# EasyEDA schematic pcb.json

## Sheets
1 Sheet_2: TITLE: Sheet_2; REV: 1.0; Date: 2019-10-17; Sheet: 1/1; Drawn By: Sobotkama; Company: Your Company
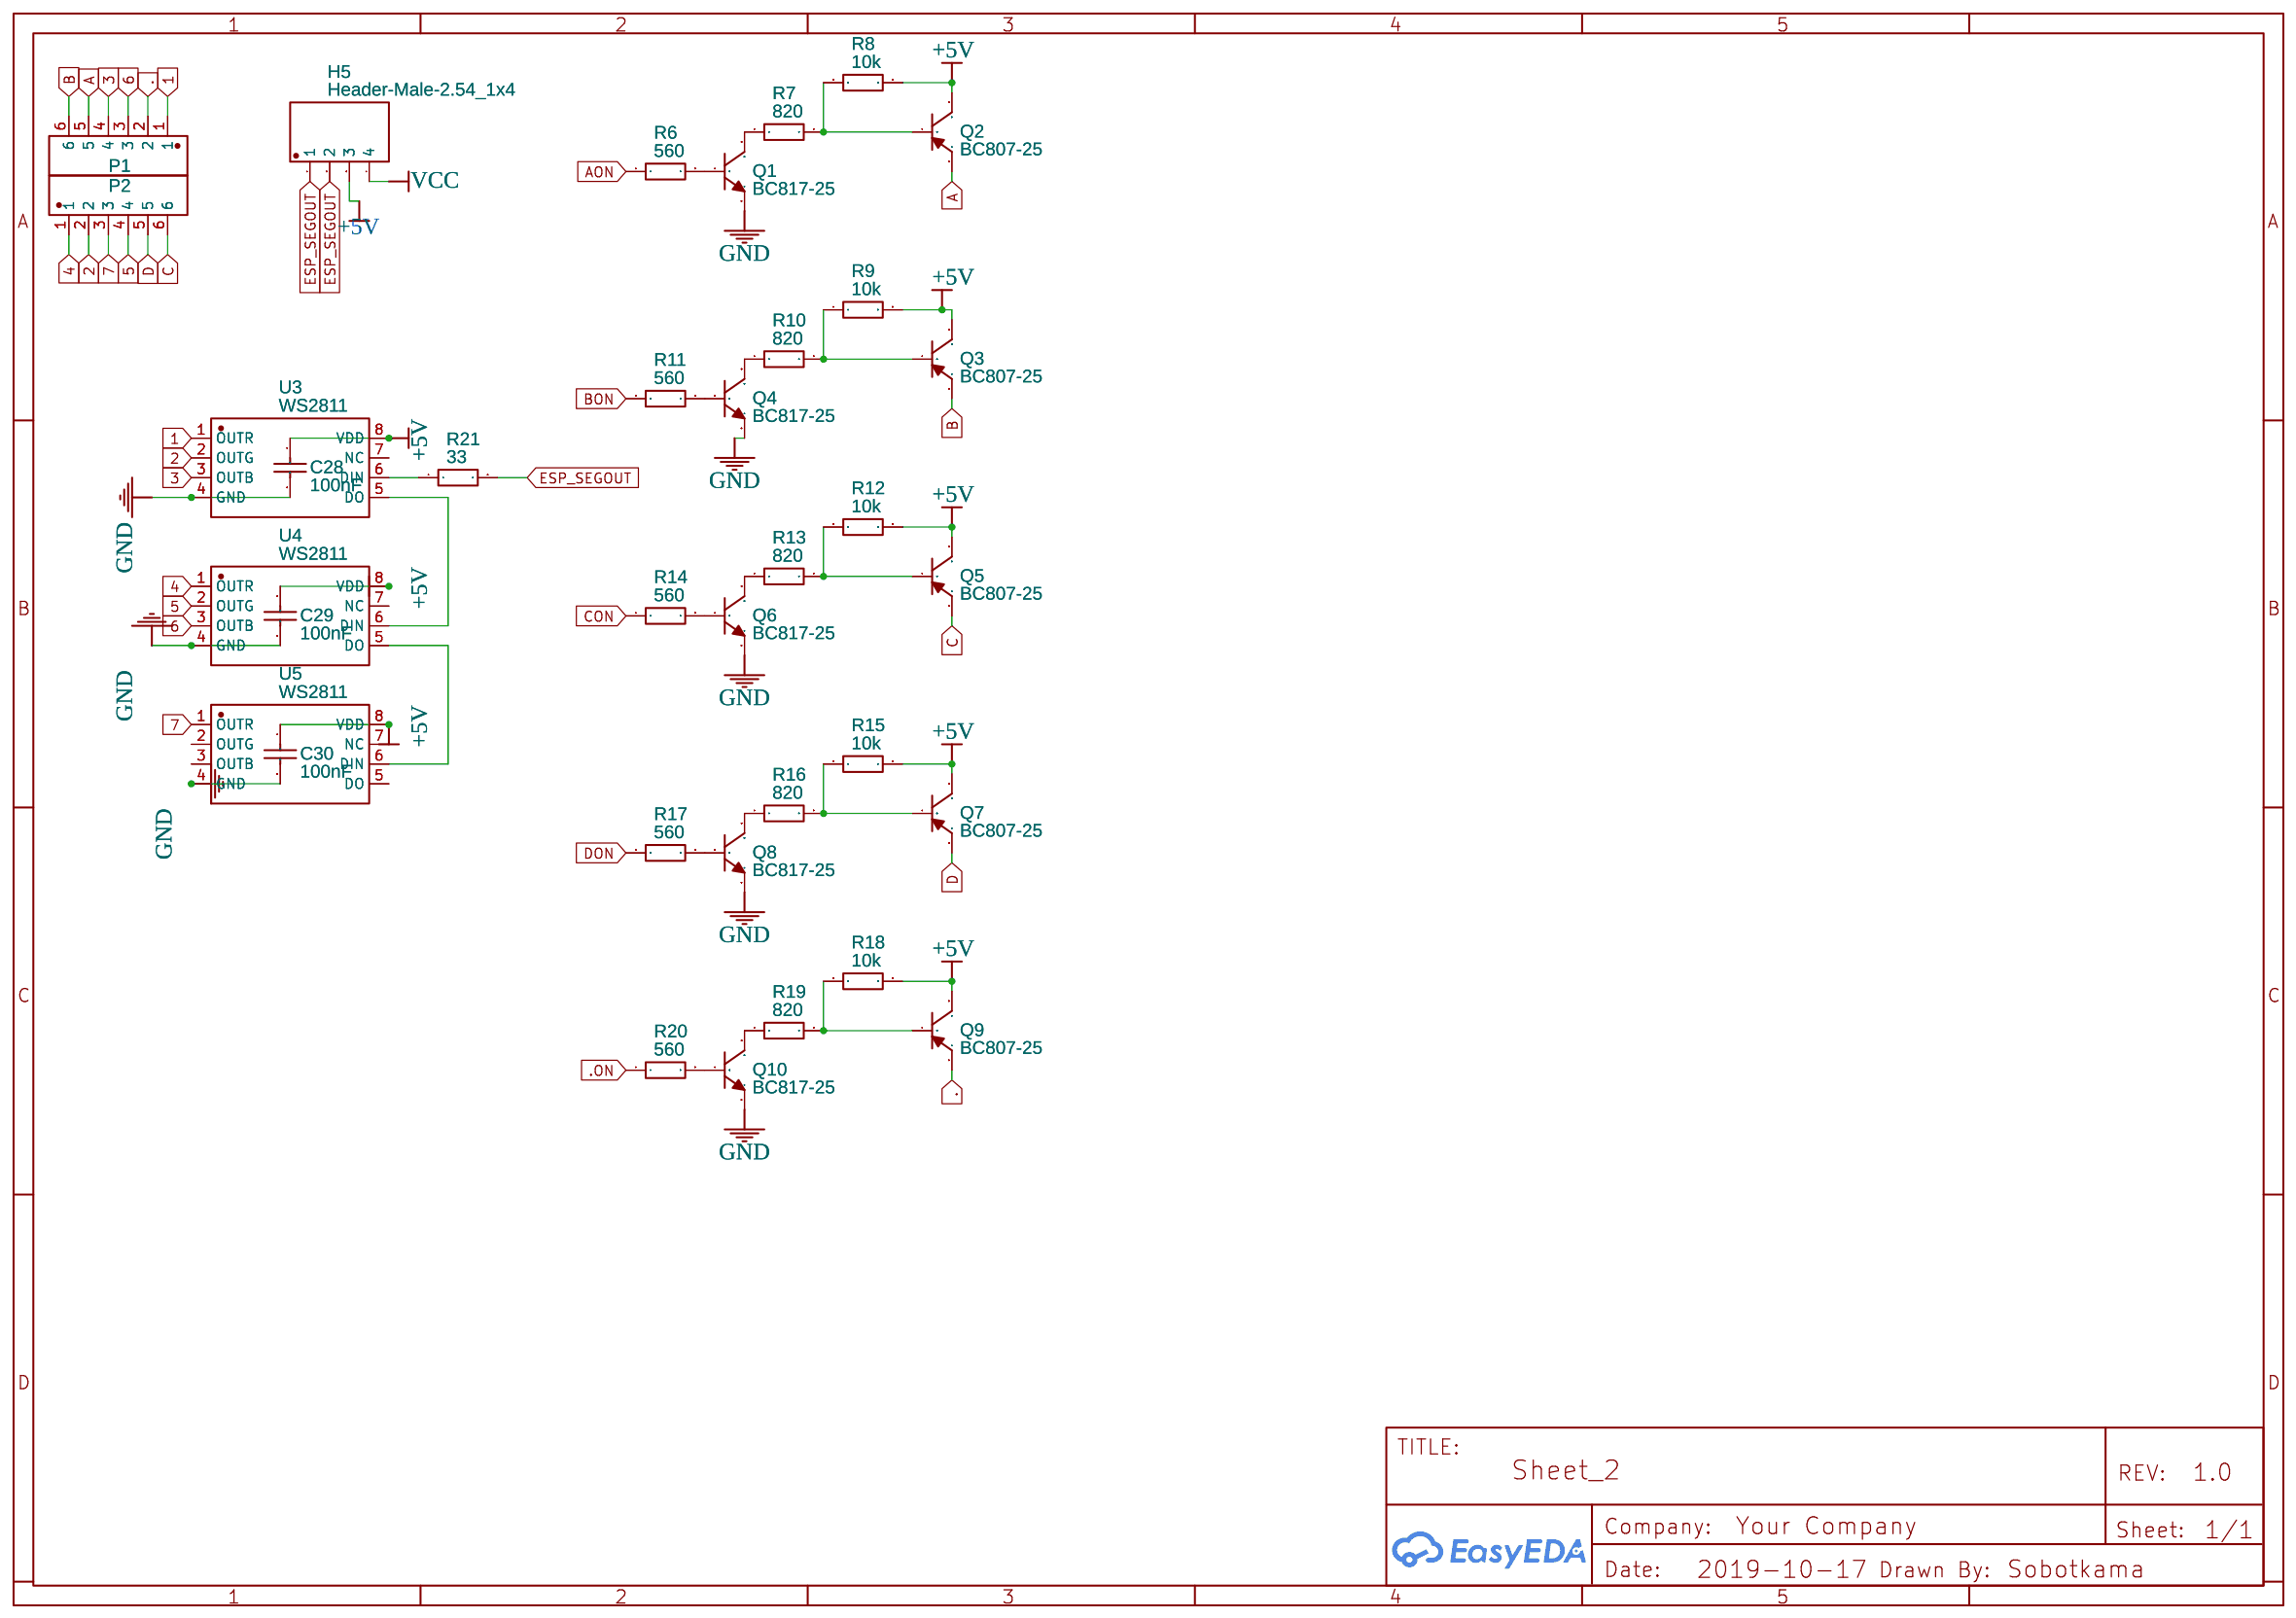
[diagram p0: Sheet_2]
2 Sheet_1: TITLE: Sheet_1; Date: 2019-09-26; Company: DDM P9
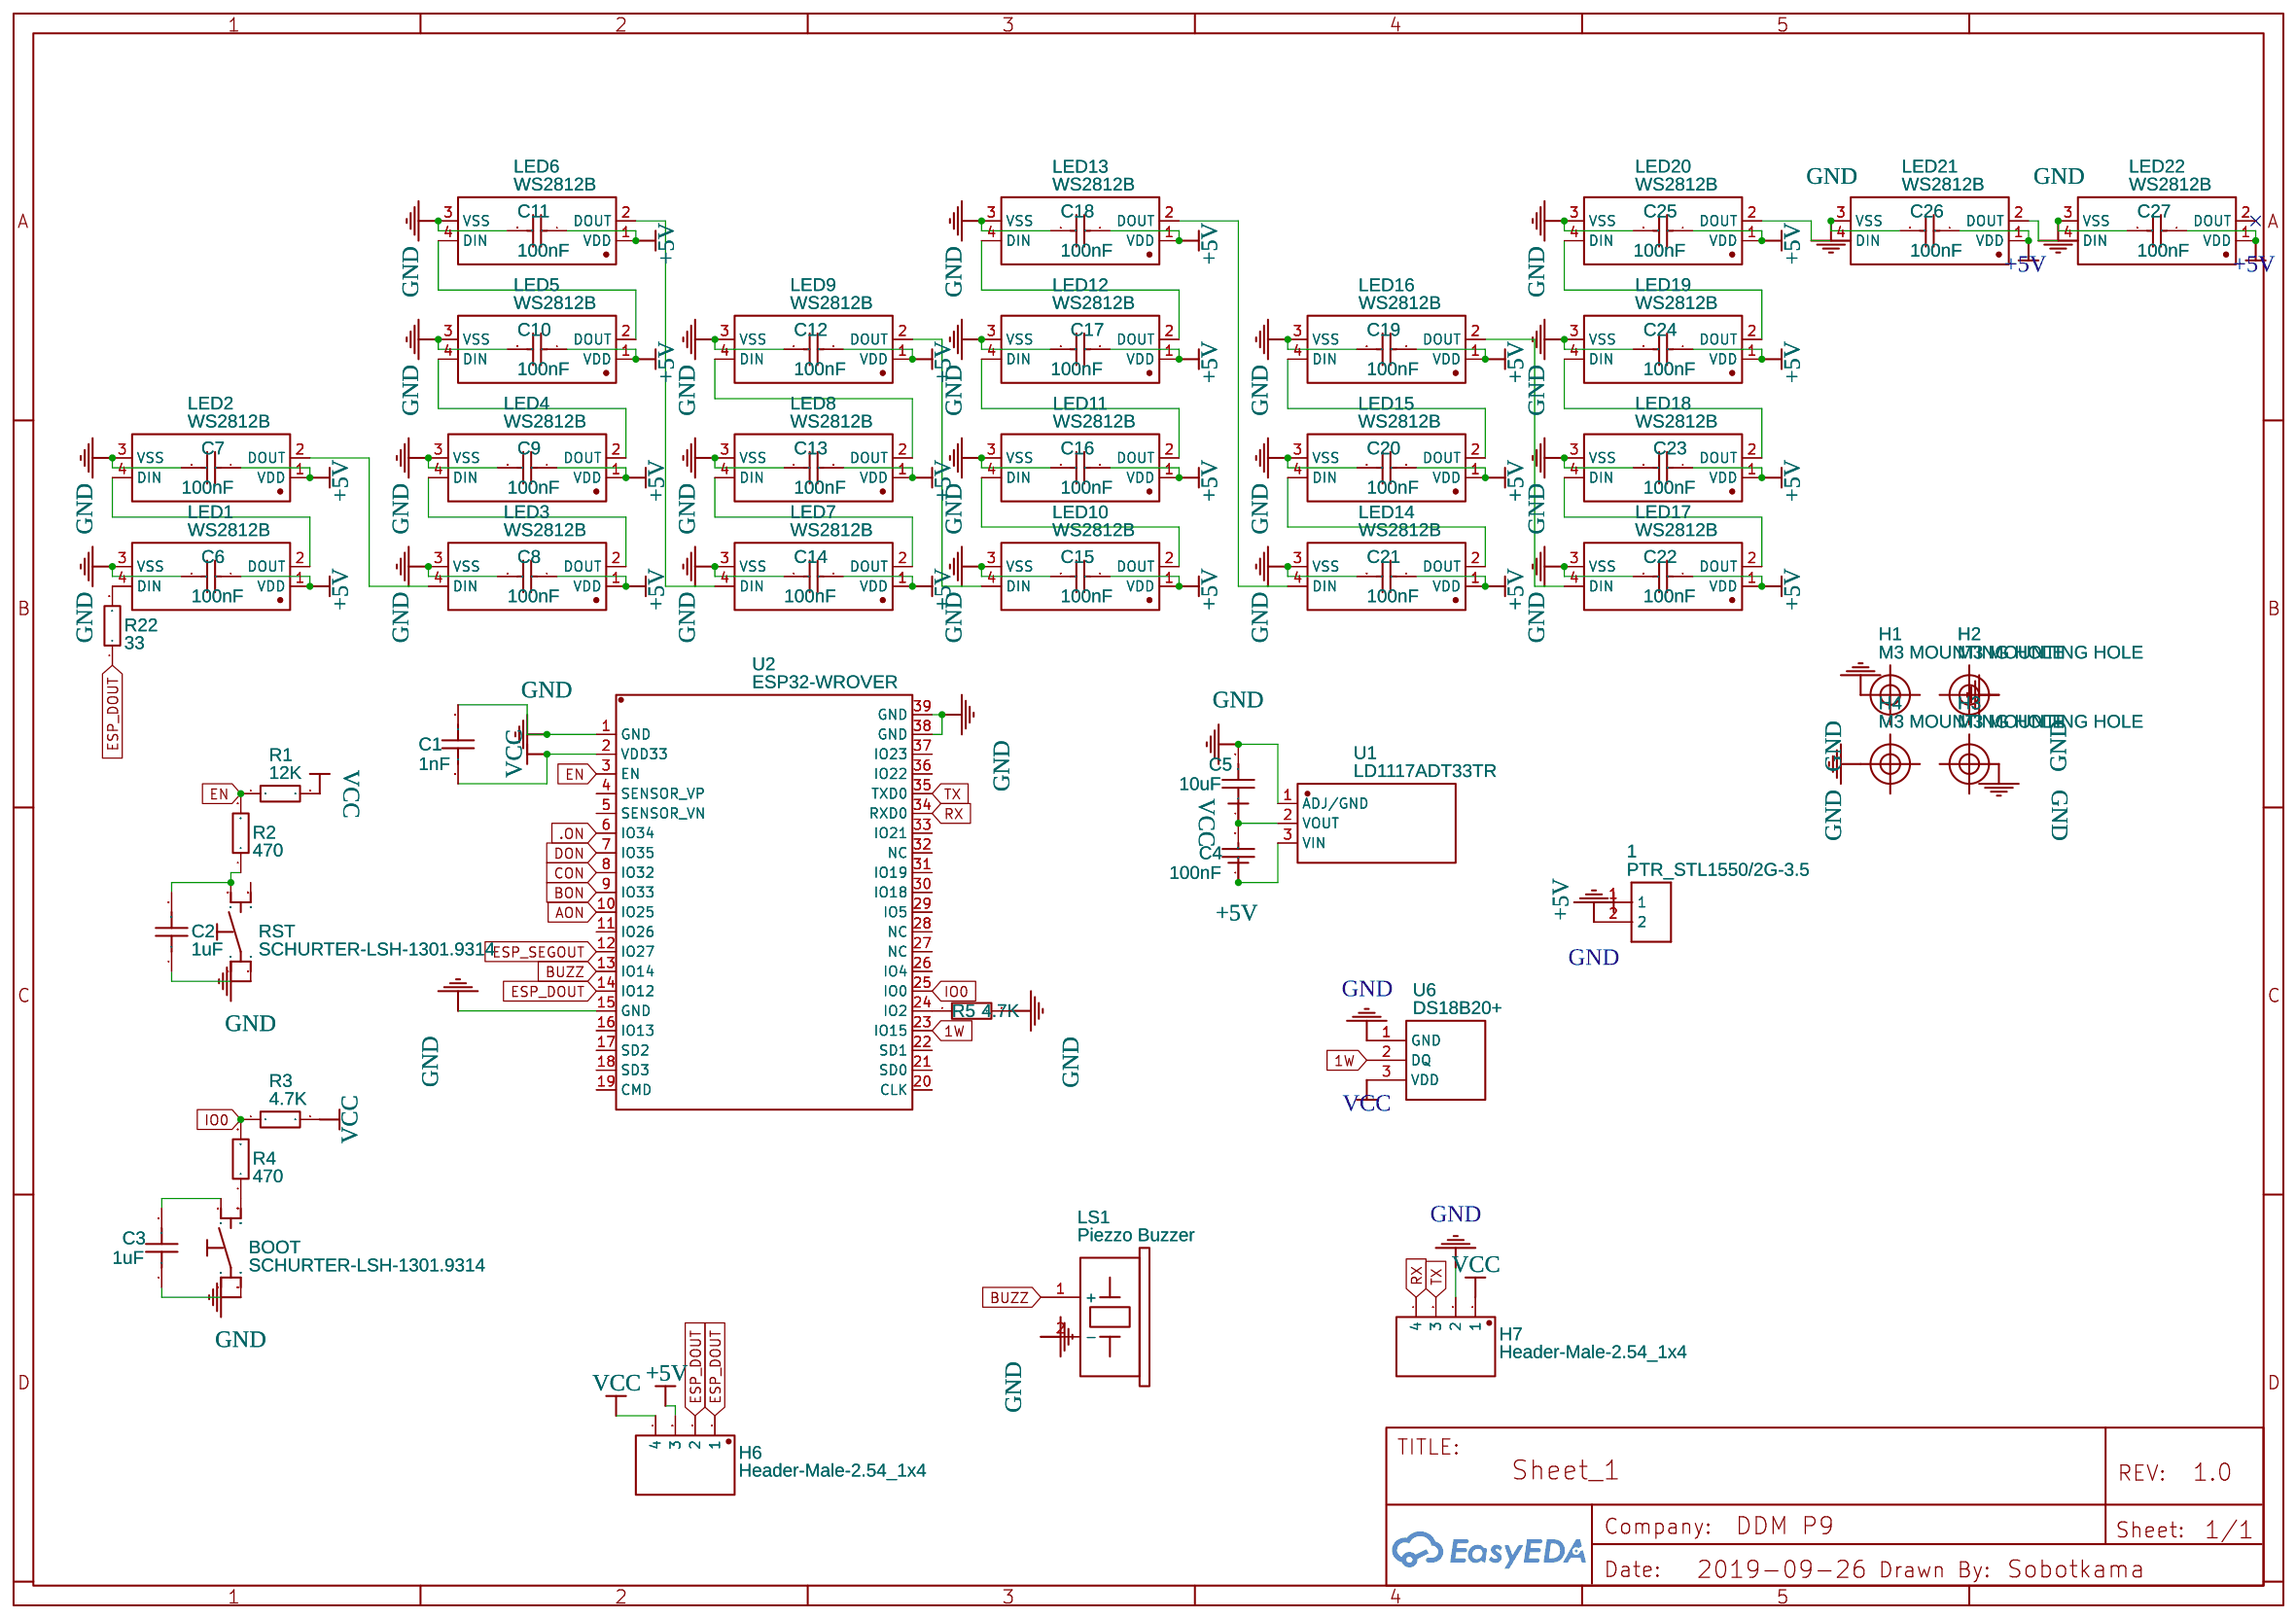
[diagram p1: Sheet_1]
3 DISPLAY_MAP: TITLE: Sheet_3; Date: 2019-10-24
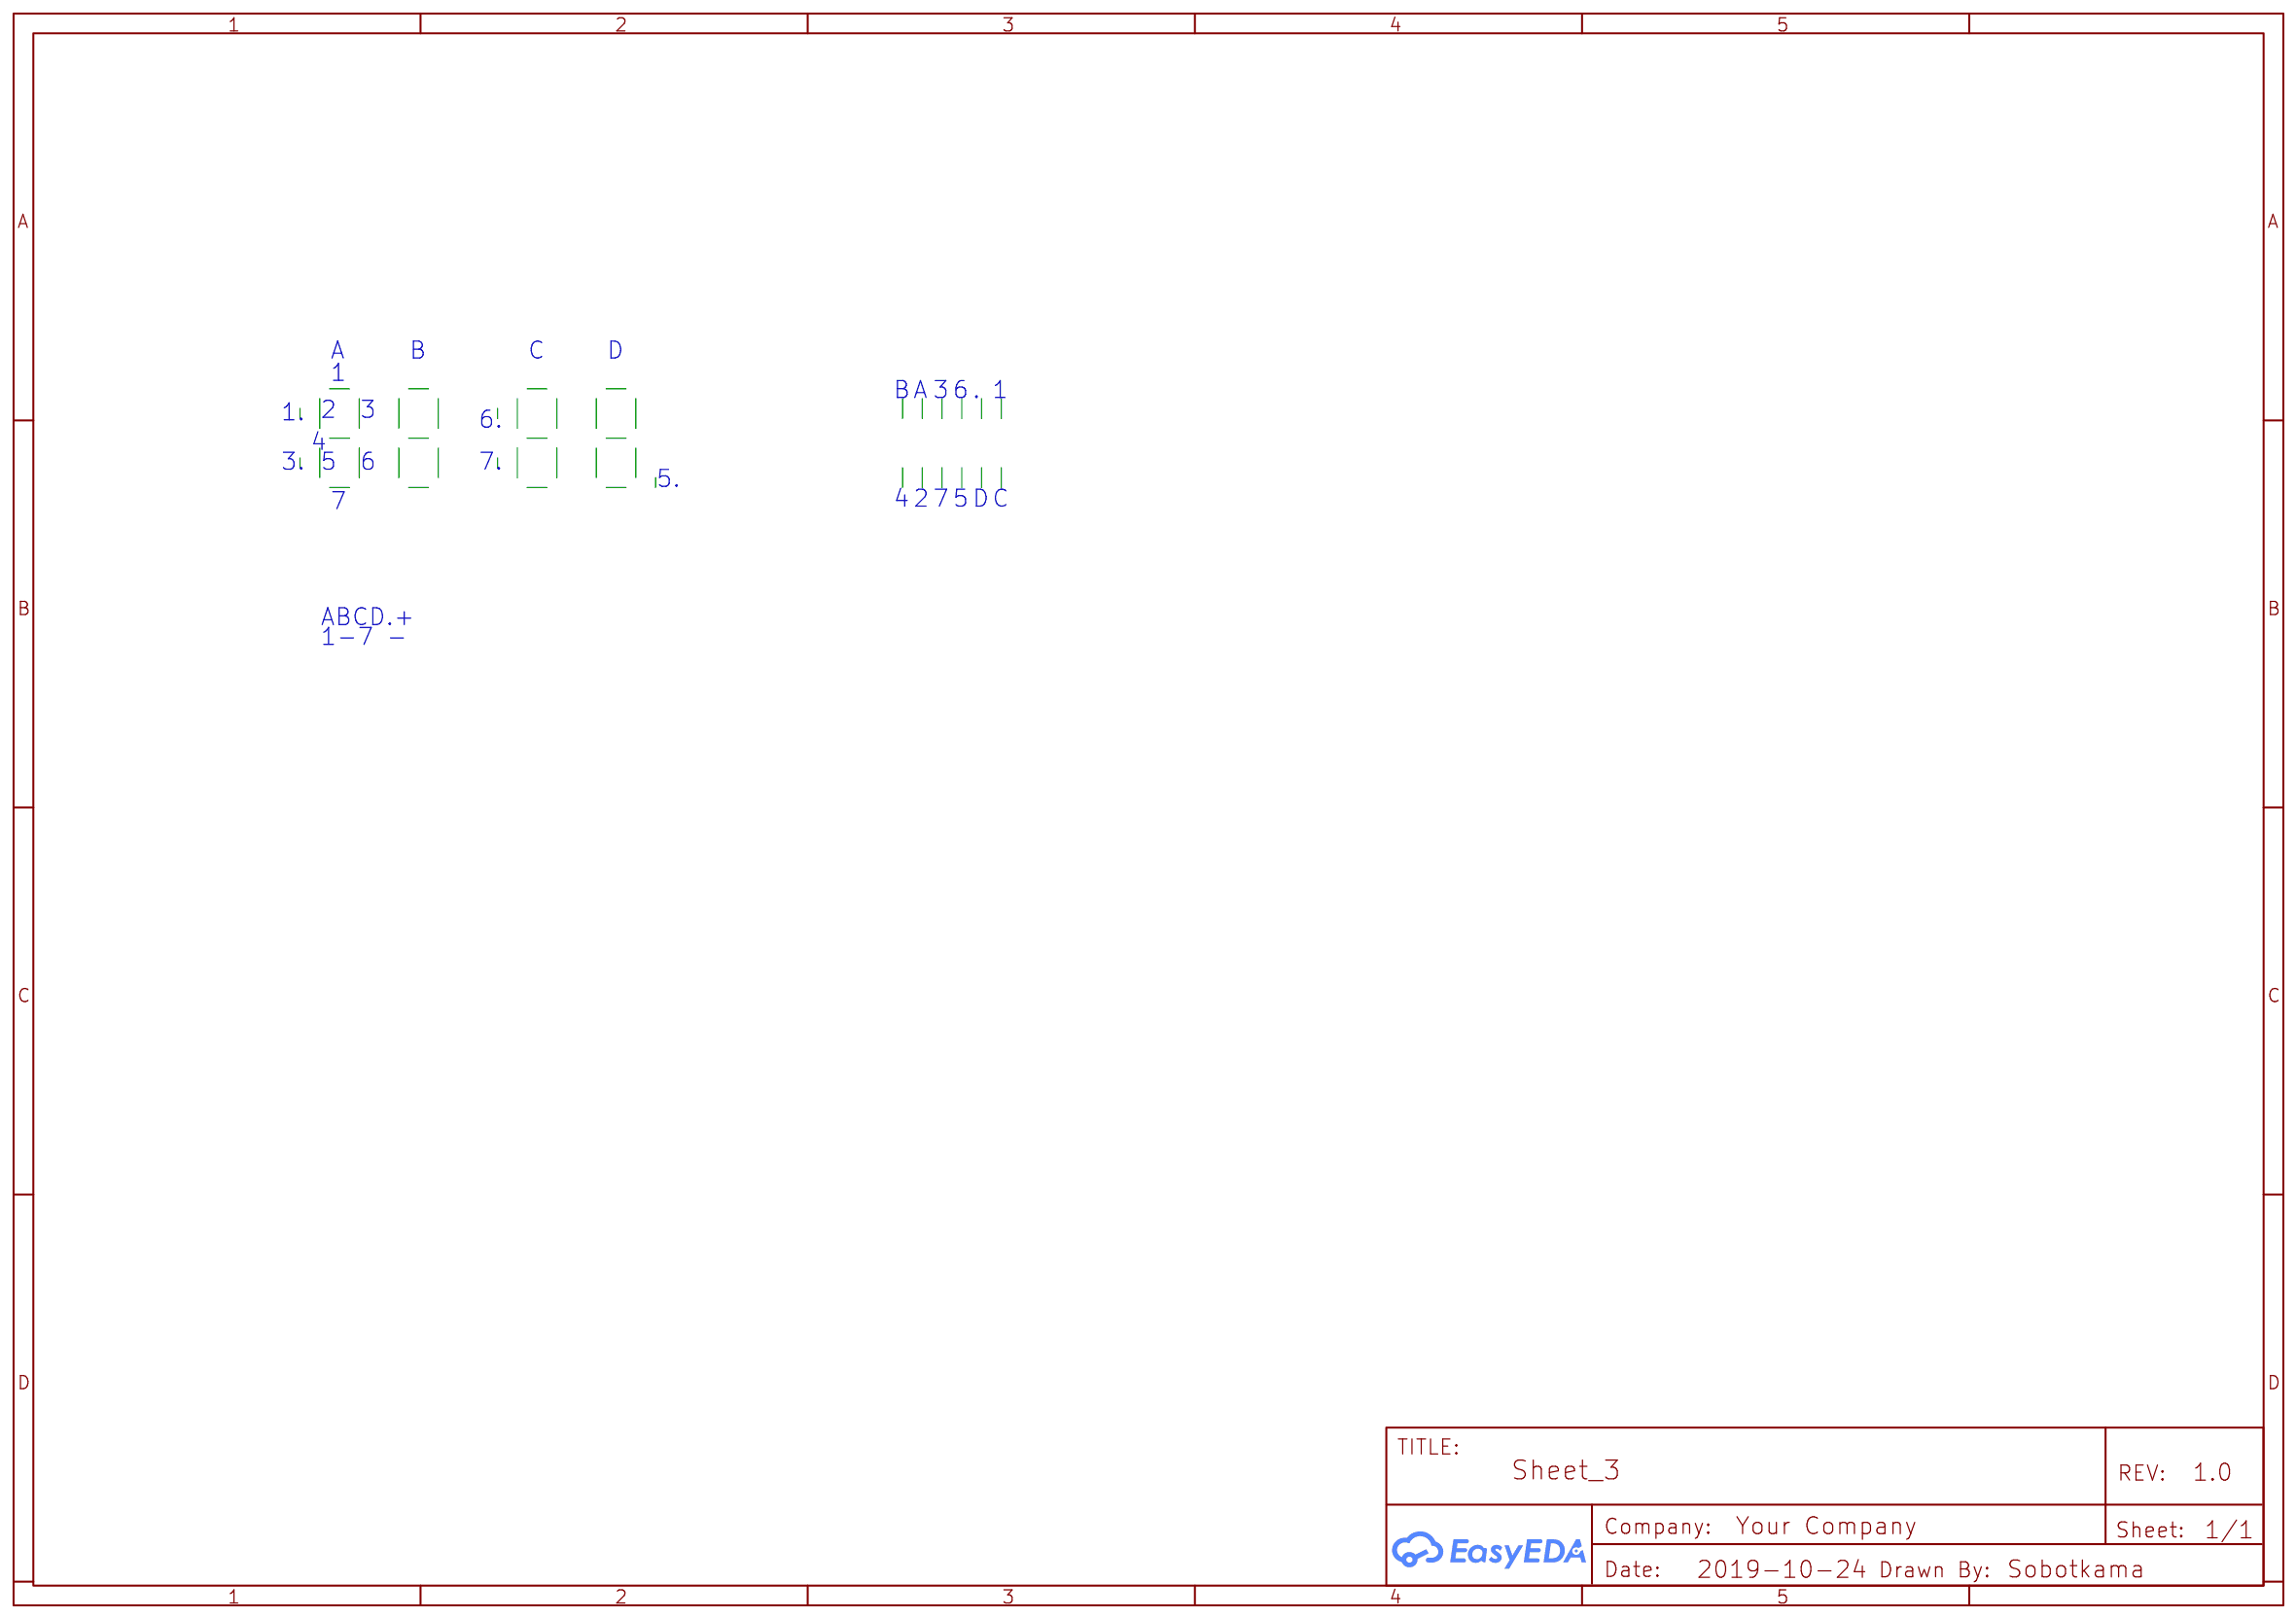
[diagram p2: DISPLAY_MAP]

## Parts
sheet Sheet_1
1  PTR_STL1550/2G-3.5  [PTR_STL1550/2G-3.5]
BOOT  SCHURTER-LSH-1301.9314  [LSH]
C1  1nF  [1206]
C2  1uF  [1206]
C3  1uF  [1206]
C4  100nF  [1206]
C5  10uF  [1206]
C6  100nF  [1206]
C7  100nF  [1206]
C8  100nF  [1206]
C9  100nF  [1206]
C10  100nF  [1206]
C11  100nF  [1206]
C12  100nF  [1206]
C13  100nF  [1206]
C14  100nF  [1206]
C15  100nF  [1206]
C16  100nF  [1206]
C17  100nF  [1206]
C18  100nF  [1206]
C19  100nF  [1206]
C20  100nF  [1206]
C21  100nF  [1206]
C22  100nF  [1206]
C23  100nF  [1206]
C24  100nF  [1206]
C25  100nF  [1206]
C26  100nF  [1206]
C27  100nF  [1206]
H1  M3 MOUNTING HOLE  [M3 MOUNTING HOLE]
H2  M3 MOUNTING HOLE  [M3 MOUNTING HOLE]
H3  M3 MOUNTING HOLE  [M3 MOUNTING HOLE]
H4  M3 MOUNTING HOLE  [M3 MOUNTING HOLE]
H6  Header-Male-2.54_1x4  [210S-1X4P]
H7  Header-Male-2.54_1x4  [210S-1X4P]
LED1  WS2812B  [LED-5050_4P]
LED2  WS2812B  [LED-5050_4P]
LED3  WS2812B  [LED-5050_4P]
LED4  WS2812B  [LED-5050_4P]
LED5  WS2812B  [LED-5050_4P]
LED6  WS2812B  [LED-5050_4P]
LED7  WS2812B  [LED-5050_4P]
LED8  WS2812B  [LED-5050_4P]
LED9  WS2812B  [LED-5050_4P]
LED10  WS2812B  [LED-5050_4P]
LED11  WS2812B  [LED-5050_4P]
LED12  WS2812B  [LED-5050_4P]
LED13  WS2812B  [LED-5050_4P]
LED14  WS2812B  [LED-5050_4P]
LED15  WS2812B  [LED-5050_4P]
LED16  WS2812B  [LED-5050_4P]
LED17  WS2812B  [LED-5050_4P]
LED18  WS2812B  [LED-5050_4P]
LED19  WS2812B  [LED-5050_4P]
LED20  WS2812B  [LED-5050_4P]
LED21  WS2812B  [LED-5050_4P]
LED22  WS2812B  [LED-5050_4P]
LS1  Piezzo Buzzer  [PIEZZO BUZZER 12MM]
R1  12K  [1206]
R2  470  [1206]
R3  4.7K  [1206]
R4  470  [1206]
R5  4.7K  [1206]
R22  33  [1206]
RST  SCHURTER-LSH-1301.9314  [LSH]
U1  LD1117ADT33TR  [TO-252-2(DPAK)]
U2  ESP32-WROVER  [ESP32-WROVER]
U6  DS18B20+  [TO-92-3_L4.9-W3.7-P1.27-L]
sheet Sheet_2
C28  100nF  [1206]
C29  100nF  [1206]
C30  100nF  [1206]
H5  Header-Male-2.54_1x4  [210S-1X4P]
P1  Header-Female-2.54_1x6  [HDR-TH_6P-P2.54-V]
P2  Header-Female-2.54_1x6  [HDR-TH_6P-P2.54-V]
Q1  BC817-25  [SOT-23-3_L2.9-W1.6-P1.90-LS2.8-BR]
Q2  BC807-25  [SOT-23-3_L2.9-W1.6-P1.90-LS2.8-BR]
Q3  BC807-25  [SOT-23-3_L2.9-W1.6-P1.90-LS2.8-BR]
Q4  BC817-25  [SOT-23-3_L2.9-W1.6-P1.90-LS2.8-BR]
Q5  BC807-25  [SOT-23-3_L2.9-W1.6-P1.90-LS2.8-BR]
Q6  BC817-25  [SOT-23-3_L2.9-W1.6-P1.90-LS2.8-BR]
Q7  BC807-25  [SOT-23-3_L2.9-W1.6-P1.90-LS2.8-BR]
Q8  BC817-25  [SOT-23-3_L2.9-W1.6-P1.90-LS2.8-BR]
Q9  BC807-25  [SOT-23-3_L2.9-W1.6-P1.90-LS2.8-BR]
Q10  BC817-25  [SOT-23-3_L2.9-W1.6-P1.90-LS2.8-BR]
R6  560  [1206]
R7  820  [1206]
R8  10k  [1206]
R9  10k  [1206]
R10  820  [1206]
R11  560  [1206]
R12  10k  [1206]
R13  820  [1206]
R14  560  [1206]
R15  10k  [1206]
R16  820  [1206]
R17  560  [1206]
R18  10k  [1206]
R19  820  [1206]
R20  560  [1206]
R21  33  [1206]
U3  WS2811  [SOP-8_L4.9-W3.9-P1.27-LS6.0-BL]
U4  WS2811  [SOP-8_L4.9-W3.9-P1.27-LS6.0-BL]
U5  WS2811  [SOP-8_L4.9-W3.9-P1.27-LS6.0-BL]

## Library data of the parts
1 = -: Contributor: Antonín Kotěra
C1 = TCC1206X7R102K251DT: Supplier: LCSC; Supplier Part: C282816; Manufacturer: CCTC; Contributor: LCSC
C2 C3 = GCM31MR71H105KA55L: Supplier: LCSC; Manufacturer: MuRata; Supplier Part: C85867
C4 = C1206U104J050T: Supplier: LCSC; Manufacturer: HEC; Contributor: LCSC; Supplier Part: C158070
C5 = 1206X106K160: Supplier: LCSC; Supplier Part: C105210; Manufacturer: Walsin Tech Corp; Contributor: LCSC
C6-C30 = CL31B104KCFNNNE: Supplier: LCSC; Manufacturer: SAMSUNG; Supplier Part: C1945; LCSC Assembly: Yes; SMT Type: Extend
H1-H4 = -: Manufacturer Part: M3 Mounting Hole; link: This is a 3.125mm mounting hole; Contributor: petre.marius
H5-H7 = Header-Male-2.54_1x4: Supplier: LCSC; Manufacturer: Ckmtw; Manufacturer Part: 210S-1*4P L=11.6MMGold-plated black; Contributor: LCSC; Supplier Part: C124378
LED1-LED22 = -: Supplier: LCSC; Manufacturer: Worldsemi; Contributor: LCSC; Supplier Part: C114585
LS1 = -: Contributor: tobiastoifl
R1 = AC1206FR-0712KL: Supplier: LCSC; Supplier Part: C229302; Manufacturer: YAGEO; Contributor: LCSC
R2 R4 = AECR1206F470RK9: Supplier: LCSC; Supplier Part: C352069; Manufacturer: ResistorToday; Contributor: LCSC
R3 R5 = CRCW12064K70FKEA: Supplier: LCSC; Supplier Part: C242482; Manufacturer: Vishay Intertech; Contributor: LCSC
R21 R22 = RT1206FRD0720RL: Supplier: LCSC; Manufacturer: YAGEO; Contributor: LCSC; Supplier Part: C136871
U1 = -: Supplier: LCSC; Manufacturer: STMicroelectronics; Contributor: LCSC; Supplier Part: C157401; LCSC Assembly: Yes; SMT Type: Extend
U2 = -: Supplier: LCSC; Supplier Part: C129145; Manufacturer: Espressif Systems; Contributor: LCSC
U6 = -: Supplier: LCSC; Manufacturer: MAXIM; image: //image.lceda.cn/szlcsc/C9753.jpg; Supplier Part: C9753
P1 P2 = -: Supplier: LCSC; Manufacturer: BOOMELE; Manufacturer Part: Female header 1*6p; Supplier Part: C40877
Q1 Q4 Q6 Q8 Q10 = -: Supplier: LCSC; Manufacturer: CJ; image: //image.lceda.cn/szlcsc/C8588.jpg; Supplier Part: C8588; LCSC Assembly: Yes; SMT Type: Extend
Q2 Q3 Q5 Q7 Q9 = -: Supplier: LCSC; Manufacturer: Hottech; Contributor: LCSC; Supplier Part: C181150; LCSC Assembly: Yes; SMT Type: Extend
R6 R11 R14 R17 R20 = RMC12065601%N: Supplier: LCSC; Supplier Part: C269625; Manufacturer: Tyohm; Contributor: LCSC
R7 R10 R13 R16 R19 = RC1206JR-071KL: Supplier: LCSC; Manufacturer: YAGEO; Supplier Part: C112223
R8 R9 R12 R15 R18 = AECR1206F4K70K9: Supplier: LCSC; Supplier Part: C352065; Manufacturer: ResistorToday; Contributor: LCSC
U3-U5 = -: Supplier: LCSC; Supplier Part: C114581; Manufacturer: Worldsemi; Contributor: LCSC; LCSC Assembly: Yes; SMT Type: Extend

## Nets
+5V: 1.1 C4.1 C6.1 C7.1 C8.1 C9.1 C10.1 C11.1 C12.1 C13.1 C14.1 C15.1 C16.1 C17.1 C18.1 C19.1 C20.1 C21.1 C22.1 C23.1 C24.1 C25.1 C26.1 C27.1 C28.1 C29.1 C30.1 H5.3 H6.3 LED1.1(VDD) LED2.1(VDD) LED3.1(VDD) LED4.1(VDD) LED5.1(VDD) LED6.1(VDD) LED7.1(VDD) LED8.1(VDD) LED9.1(VDD) LED10.1(VDD) LED11.1(VDD) LED12.1(VDD) LED13.1(VDD) LED14.1(VDD) LED15.1(VDD) LED16.1(VDD) LED17.1(VDD) LED18.1(VDD) LED19.1(VDD) LED20.1(VDD) LED21.1(VDD) LED22.1(VDD) Q2.3(C) Q3.3(C) Q5.3(C) Q7.3(C) Q9.3(C) R8.2 R9.2 R12.2 R15.2 R18.2 U1.3(VIN) U3.8(VDD) U4.8(VDD) U5.8(VDD)
GND: 1.2 BOOT.C2(C) C1.2 C5.2 C6.2 C7.2 C8.2 C9.2 C10.2 C11.2 C12.2 C13.2 C14.2 C15.2 C16.2 C17.2 C18.2 C19.2 C20.2 C21.2 C22.2 C23.2 C24.2 C25.2 C26.2 C27.2 C28.2 C29.2 C30.2 H7.2 LED1.3(VSS) LED2.3(VSS) LED3.3(VSS) LED4.3(VSS) LED5.3(VSS) LED6.3(VSS) LED7.3(VSS) LED8.3(VSS) LED9.3(VSS) LED10.3(VSS) LED11.3(VSS) LED12.3(VSS) LED13.3(VSS) LED14.3(VSS) LED15.3(VSS) LED16.3(VSS) LED17.3(VSS) LED18.3(VSS) LED19.3(VSS) LED20.3(VSS) LED21.3(VSS) LED22.3(VSS) LS1.2(-) Q1.2(E) Q4.2(E) Q6.2(E) Q8.2(E) Q10.2(E) R5.2 RST.C2(C) U1.1(ADJ/GND) U2.1(GND) U2.15(GND) U2.38(GND) U2.39(GND) U3.4(GND) U4.4(GND) U5.4(GND) U6.1(GND)
VCC: C1.1 C4.2 C5.1 H5.4 H6.4 H7.1 R1.2 R3.2 U1.2(VOUT) U2.2(VDD33) U6.3(VDD)
1: P1.1 U3.1(OUTR)
1W: U2.23(IO15) U6.2(DQ)
2: P2.2 U3.2(OUTG)
3: P1.4 U3.3(OUTB)
4: P2.1 U4.1(OUTR)
5: P2.4 U4.2(OUTG)
6: P1.3 U4.3(OUTB)
7: P2.3 U5.1(OUTR)
.: P1.2 Q9.2(E)
.ON: R20.1 U2.6(IO34)
A: P1.5 Q2.2(E)
AON: R6.1 U2.10(IO25)
B: P1.6 Q3.2(E)
BON: R11.1 U2.9(IO33)
BUZZ: LS1.1(+) U2.13(IO14)
C: P2.6 Q5.2(E)
CON: R14.1 U2.8(IO32)
D: P2.5 Q7.2(E)
DON: R17.1 U2.7(IO35)
EN: R1.1 R2.2 U2.3(EN)
ESP_DOUT: H6.1 H6.2 R22.1 U2.14(IO12)
ESP_SEGOUT: H5.1 H5.2 R21.2 U2.12(IO27)
IO0: R3.1 R4.2 U2.25(IO0)
RX: H7.4 U2.34(RXD0)
TX: H7.3 U2.35(TXD0)
Net-(BOOT-C1): BOOT.C1(C) C3.1
Net-(BOOT-NO1): BOOT.NO1(NO) C3.2
Net-(BOOT-NO2): BOOT.NO2(NO) R4.1
Net-(C2-1): C2.1 RST.C1(C)
Net-(C2-2): C2.2 R2.1 RST.NO1(NO)
Net-(LED1-2): LED1.2(DOUT) LED2.4(DIN)
Net-(LED1-4): LED1.4(DIN) R22.2
Net-(LED2-2): LED2.2(DOUT) LED3.4(DIN)
Net-(LED3-2): LED3.2(DOUT) LED4.4(DIN)
Net-(LED4-2): LED4.2(DOUT) LED5.4(DIN)
Net-(LED5-2): LED5.2(DOUT) LED6.4(DIN)
Net-(LED6-2): LED6.2(DOUT) LED7.4(DIN)
Net-(LED7-2): LED7.2(DOUT) LED8.4(DIN)
Net-(LED8-2): LED8.2(DOUT) LED9.4(DIN)
Net-(LED9-2): LED9.2(DOUT) LED10.4(DIN)
Net-(LED10-2): LED10.2(DOUT) LED11.4(DIN)
Net-(LED11-2): LED11.2(DOUT) LED12.4(DIN)
Net-(LED12-2): LED12.2(DOUT) LED13.4(DIN)
Net-(LED13-2): LED13.2(DOUT) LED14.4(DIN)
Net-(LED14-2): LED14.2(DOUT) LED15.4(DIN)
Net-(LED15-2): LED15.2(DOUT) LED16.4(DIN)
Net-(LED16-2): LED16.2(DOUT) LED17.4(DIN)
Net-(LED17-2): LED17.2(DOUT) LED18.4(DIN)
Net-(LED18-2): LED18.2(DOUT) LED19.4(DIN)
Net-(LED19-2): LED19.2(DOUT) LED20.4(DIN)
Net-(LED20-2): LED20.2(DOUT) LED21.4(DIN)
Net-(LED21-2): LED21.2(DOUT) LED22.4(DIN)
Net-(Q1-1): Q1.1(B) R6.2
Net-(Q1-3): Q1.3(C) R7.1
Net-(Q2-1): Q2.1(B) R7.2 R8.1
Net-(Q3-1): Q3.1(B) R9.1 R10.2
Net-(Q4-1): Q4.1(B) R11.2
Net-(Q4-3): Q4.3(C) R10.1
Net-(Q5-1): Q5.1(B) R12.1 R13.2
Net-(Q6-1): Q6.1(B) R14.2
Net-(Q6-3): Q6.3(C) R13.1
Net-(Q7-1): Q7.1(B) R15.1 R16.2
Net-(Q8-1): Q8.1(B) R17.2
Net-(Q8-3): Q8.3(C) R16.1
Net-(Q9-1): Q9.1(B) R18.1 R19.2
Net-(Q10-1): Q10.1(B) R20.2
Net-(Q10-3): Q10.3(C) R19.1
Net-(R5-1): R5.1 U2.24(IO2)
Net-(R21-1): R21.1 U3.6(DIN)
Net-(U3-5): U3.5(DO) U4.6(DIN)
Net-(U4-5): U4.5(DO) U5.6(DIN)

Not connected (* = marked no-connect by the designer): LED22 2(DOUT)*; RST NO2(NO); U2 4(SENSOR_VP) 5(SENSOR_VN) 11(IO26) 16(IO13) 17(SD2) 18(SD3) 19(CMD) 20(CLK) 21(SD0) 22(SD1) 26(IO4) 27(NC) 28(NC) 29(IO5) 30(IO18) 31(IO19) 32(NC) 33(IO21) 36(IO22) 37(IO23); U3 7(NC); U4 7(NC); U5 2(OUTG) 3(OUTB) 5(DO) 7(NC)

## Notes on the sheets
sheet 3
- A
- B
- C
- D
- 1
- B
- A
- 3
- 6
- .
- 1
- 1.
- 2
- 3
- 6.
- 4
- 3.
- 5
- 6
- 7.
- 5.
- 4
- 2
- 7
- 5
- D
- C
- 7
- 1-7 -
- ABCD.+
